# EasyEDA schematic wumpus.json
TITLE: Lunpus; REV: 1.0.3; Date: 2022-4-16; Sheet: 1/1; Drawn By: dougmcinnes; Company: Dogwatch Games
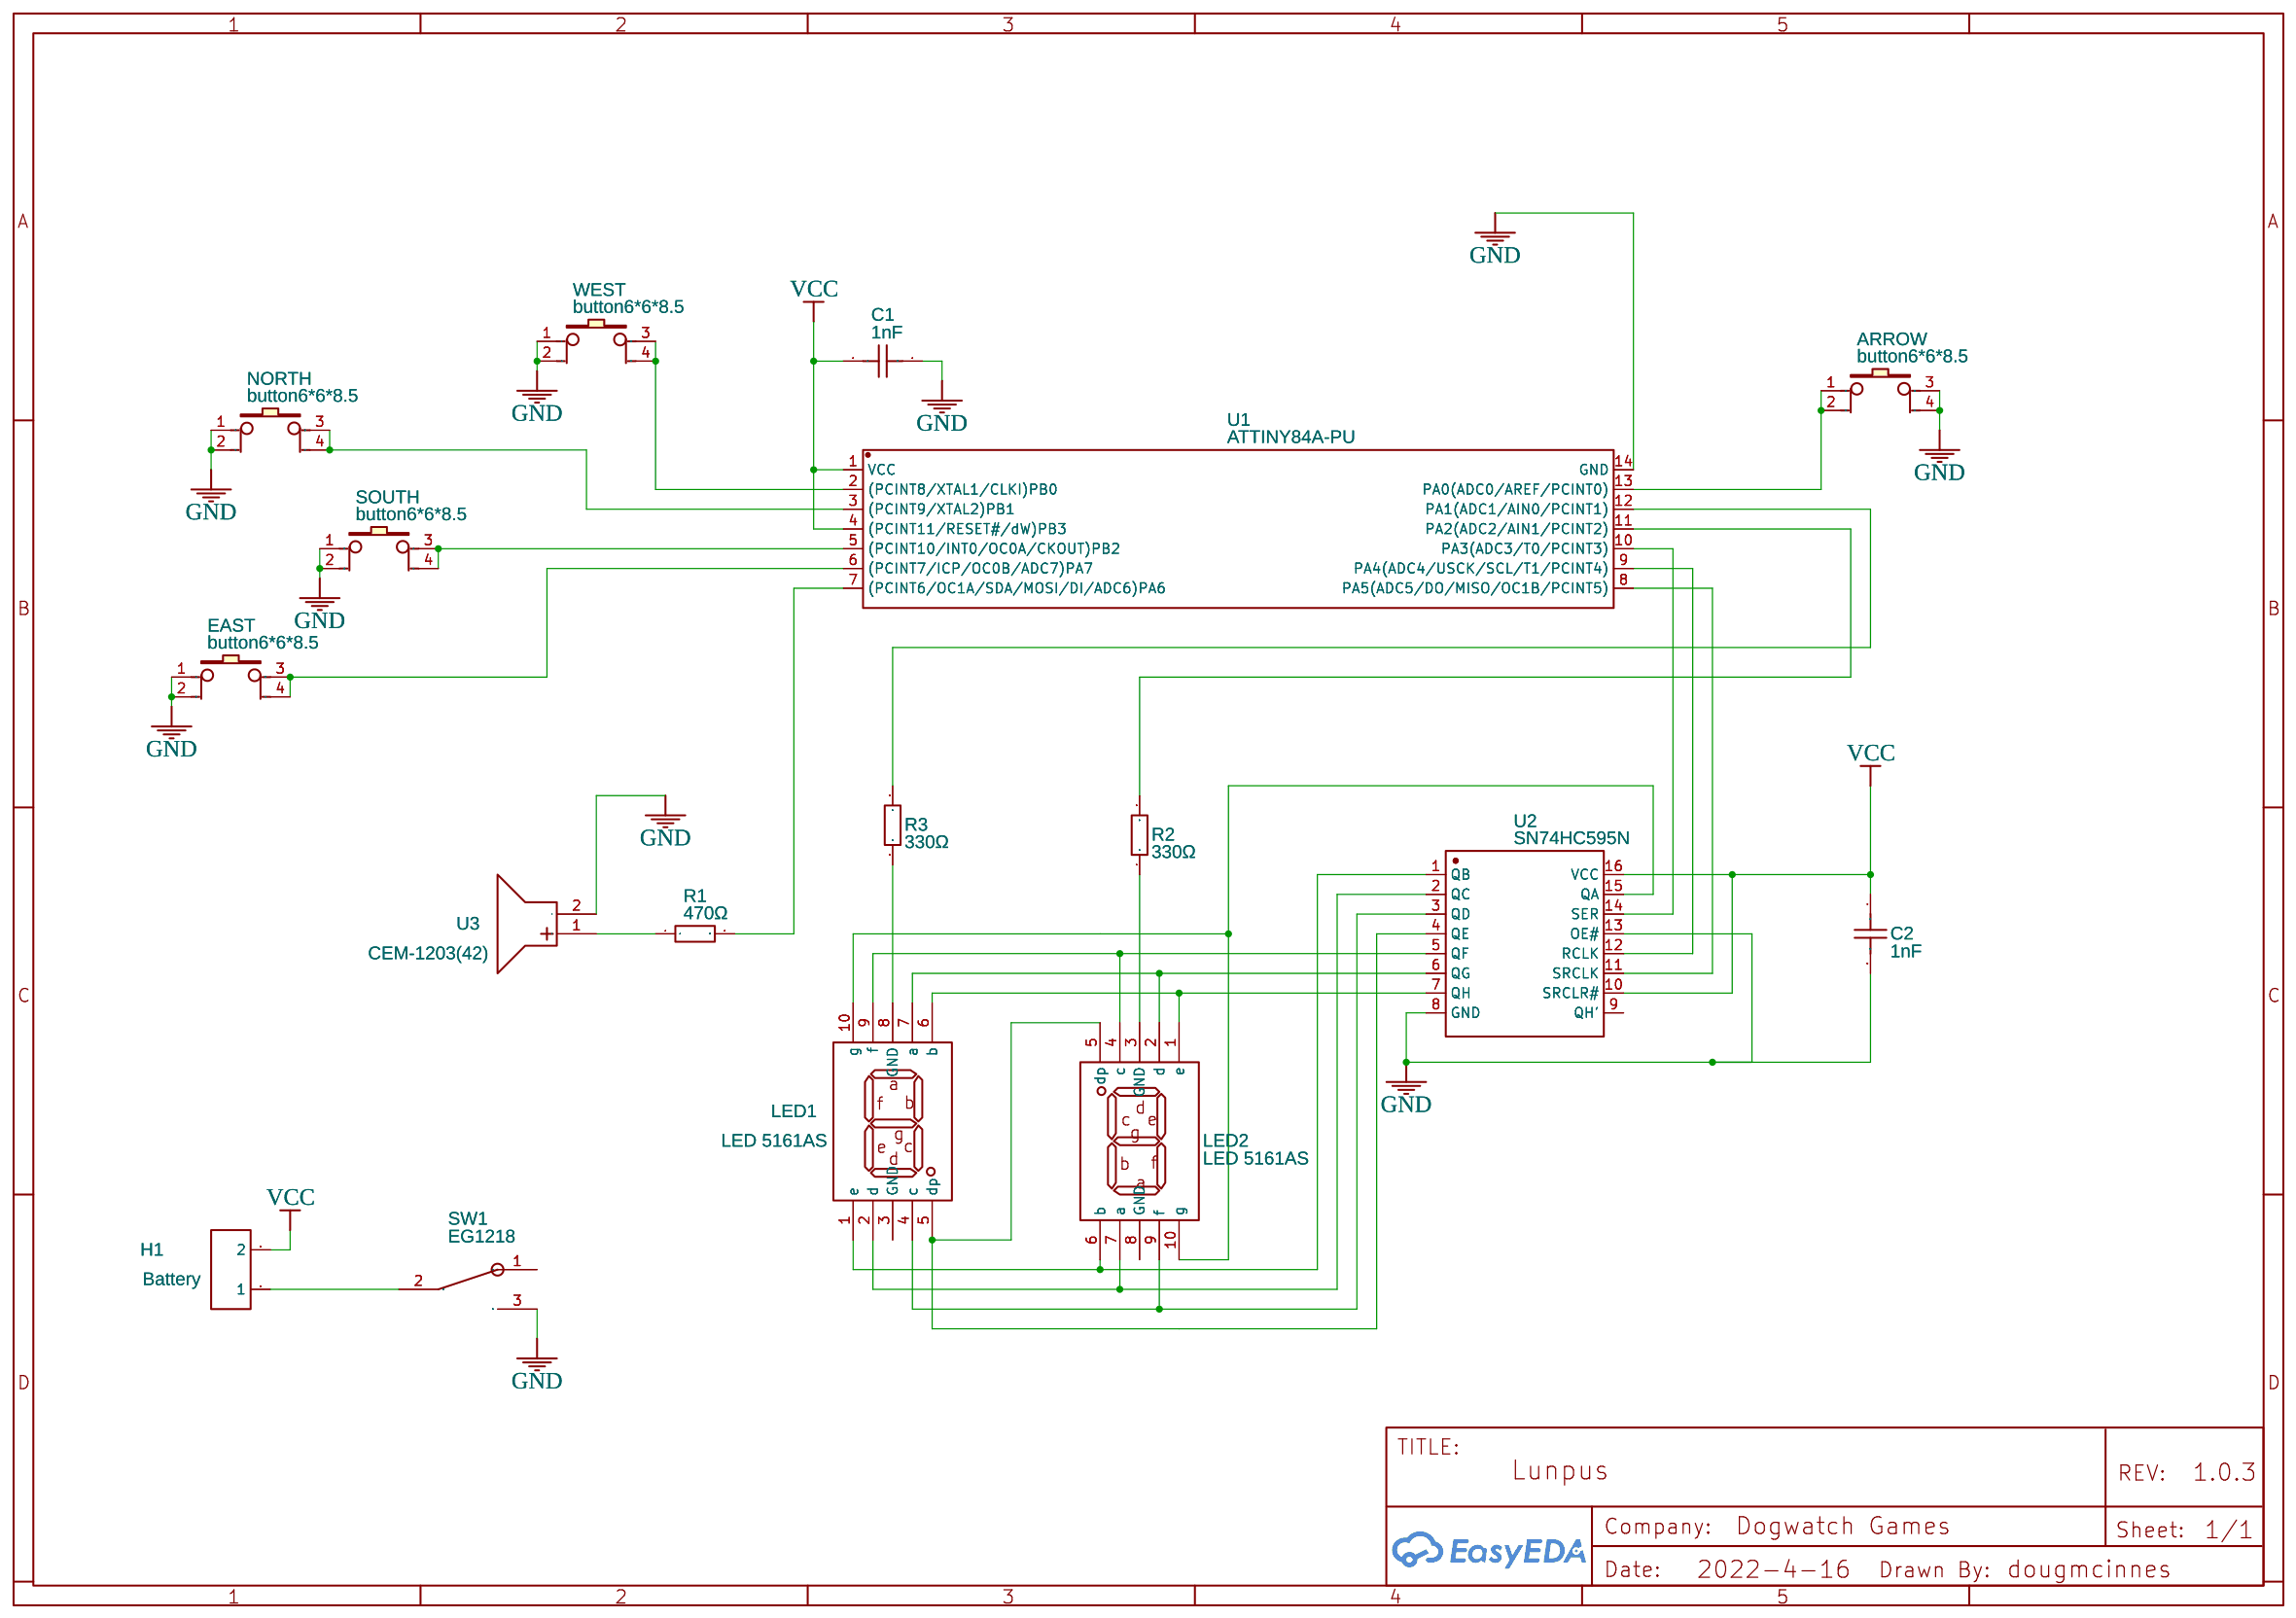
[diagram p0: schematic sheet]

## Parts
ARROW  button6*6*8.5  [KEY-TH_4P-L6.0-W6.0-P4.50]
C1  1nF  [CAP-TH_L5.0-W2.5-P2.54-D0.7]
C2  1nF  [CAP-TH_L5.0-W2.5-P2.54-D0.7]
EAST  button6*6*8.5  [KEY-TH_4P-L6.0-W6.0-P4.50]
H1  Battery  [HDR-TH_2P-P2.54-V-M-1]
LED1  LED 5161AS  [LEDSEG_0.39_1]
LED2  LED 5161AS  [LEDSEG_0.39_1]
NORTH  button6*6*8.5  [KEY-TH_4P-L6.0-W6.0-P4.50]
R1  470Ω  [AXIAL-0.3]
R2  330Ω  [AXIAL-0.4]
R3  330Ω  [AXIAL-0.4]
SOUTH  button6*6*8.5  [KEY-TH_4P-L6.0-W6.0-P4.50]
SW1  EG1218  [SW-TH_EG1218]
U1  ATTINY84A-PU  [DIP-14_L19.2-W6.6-P2.54-LS10.9-BL]
U2  SN74HC595N  [DIP-16_L19.8-W6.5-P2.54-LS7.6-BL]
U3  CEM-1203(42)  [CEM-1203(42)]
WEST  button6*6*8.5  [KEY-TH_4P-L6.0-W6.0-P4.50]

## Library data of the parts
ARROW EAST NORTH SOUTH WEST = button6*6*8.5: Supplier Part: C59980; Supplier: LCSC; Manufacturer: ReliaPro
C1 C2 = CC1H102MA1PDB44B3003: Supplier: LCSC; Supplier Part: C353905; Manufacturer: Dersonic; Contributor: LCSC; JLCPCB Part Class: Extended Part
H1 = Header-Male-2.54_1x2: Supplier: LCSC; Manufacturer: TE Connectivity; Manufacturer Part: 826629-2; Supplier Part: C86471; JLCPCB Part Class: Extended Part
LED1 LED2 = LED 5161AS: Supplier: LCSC; Manufacturer: ReliaPro; Manufacturer Part: FJ3191AH; image: //image.lceda.cn/szlcsc/C44296.jpg; Supplier Part: C44296
R1 = 470Ω: Power: 1/8W; Tolerance: ±1%; Supplier Part: C61674; Supplier: LCSC; Manufacturer: UniOhm; Manufacturer Part: MFR0W8F4700A50
R2 R3 = 330Ω: Power: 1/4W; Tolerance: ±1%; Supplier Part: C58608; Supplier: LCSC; Manufacturer: UniOhm; Manufacturer Part: MFR0W4F3300A50
SW1 = EG1218: Supplier: LCSC; Supplier Part: C273394; Manufacturer: E-Switch; Contributor: LCSC; JLCPCB Part Class: Extended Part
U1 = ATTINY84A-PU: Supplier: LCSC; Manufacturer: MICROCHIP; Contributor: LCSC; Supplier Part: C145560; JLCPCB Part Class: Extended Part
U2 = SN74HC595N: Supplier: LCSC; Manufacturer: TI; Supplier Part: C78711; JLCPCB Part Class: Extended Part
U3 = CEM-1203(42): Supplier: Digi-Key; Supplier Part: 102-1153-ND; Manufacturer: CUI Devices; Contributor: LucAce; link: https://www.cuidevices.com/product/resource/digikeypdf/cem-1203-42-.pdf

## Nets
GND: ARROW.3 ARROW.4 C1.1 C2.2 EAST.1 EAST.2 NORTH.1 NORTH.2 SOUTH.1 SOUTH.2 SW1.3 U1.14(GND) U2.8(GND) U2.13(OE#) U3.2(-) WEST.1 WEST.2
VCC: C1.2 C2.1 H1.2 U1.1(VCC) U1.4((PCINT11/RESET#/dW)PB3) U2.10(SRCLR#) U2.16(VCC)
Net-(ARROW-1): ARROW.1 ARROW.2 U1.13(PA0(ADC0/AREF/PCINT0))
Net-(EAST-3): EAST.3 EAST.4 U1.6((PCINT7/ICP/OC0B/ADC7)PA7)
Net-(H1-1): H1.1 SW1.2
Net-(LED1-1): LED1.1(e) LED2.6(b) U2.1(QB)
Net-(LED1-2): LED1.2(d) LED2.7(a) U2.2(QC)
Net-(LED1-4): LED1.4(c) LED2.9(f) U2.3(QD)
Net-(LED1-5): LED1.5(dp) LED2.5(dp) U2.4(QE)
Net-(LED1-6): LED1.6(b) LED2.1(e) U2.7(QH)
Net-(LED1-7): LED1.7(a) LED2.2(d) U2.6(QG)
Net-(LED1-8): LED1.8(GND) R3.1
Net-(LED1-9): LED1.9(f) LED2.4(c) U2.5(QF)
Net-(LED1-10): LED1.10(g) LED2.10(g) U2.15(QA)
Net-(LED2-3): LED2.3(GND) R2.1
Net-(NORTH-3): NORTH.3 NORTH.4 U1.3((PCINT9/XTAL2)PB1)
Net-(R1-1): R1.1 U3.1(+)
Net-(R1-2): R1.2 U1.7((PCINT6/OC1A/SDA/MOSI/DI/ADC6)PA6)
Net-(R2-2): R2.2 U1.11(PA2(ADC2/AIN1/PCINT2))
Net-(R3-2): R3.2 U1.12(PA1(ADC1/AIN0/PCINT1))
Net-(SOUTH-3): SOUTH.3 SOUTH.4 U1.5((PCINT10/INT0/OC0A/CKOUT)PB2)
Net-(U1-2): U1.2((PCINT8/XTAL1/CLKI)PB0) WEST.3 WEST.4
Net-(U1-8): U1.8(PA5(ADC5/DO/MISO/OC1B/PCINT5)) U2.11(SRCLK)
Net-(U1-9): U1.9(PA4(ADC4/USCK/SCL/T1/PCINT4)) U2.12(RCLK)
Net-(U1-10): U1.10(PA3(ADC3/T0/PCINT3)) U2.14(SER)

Not connected (* = marked no-connect by the designer): LED1 3(GND); LED2 8(GND); SW1 1; U2 9(QH')
